# Altium schematic sheet 16_WIFI_BT-1T1R.SchDoc
size A2
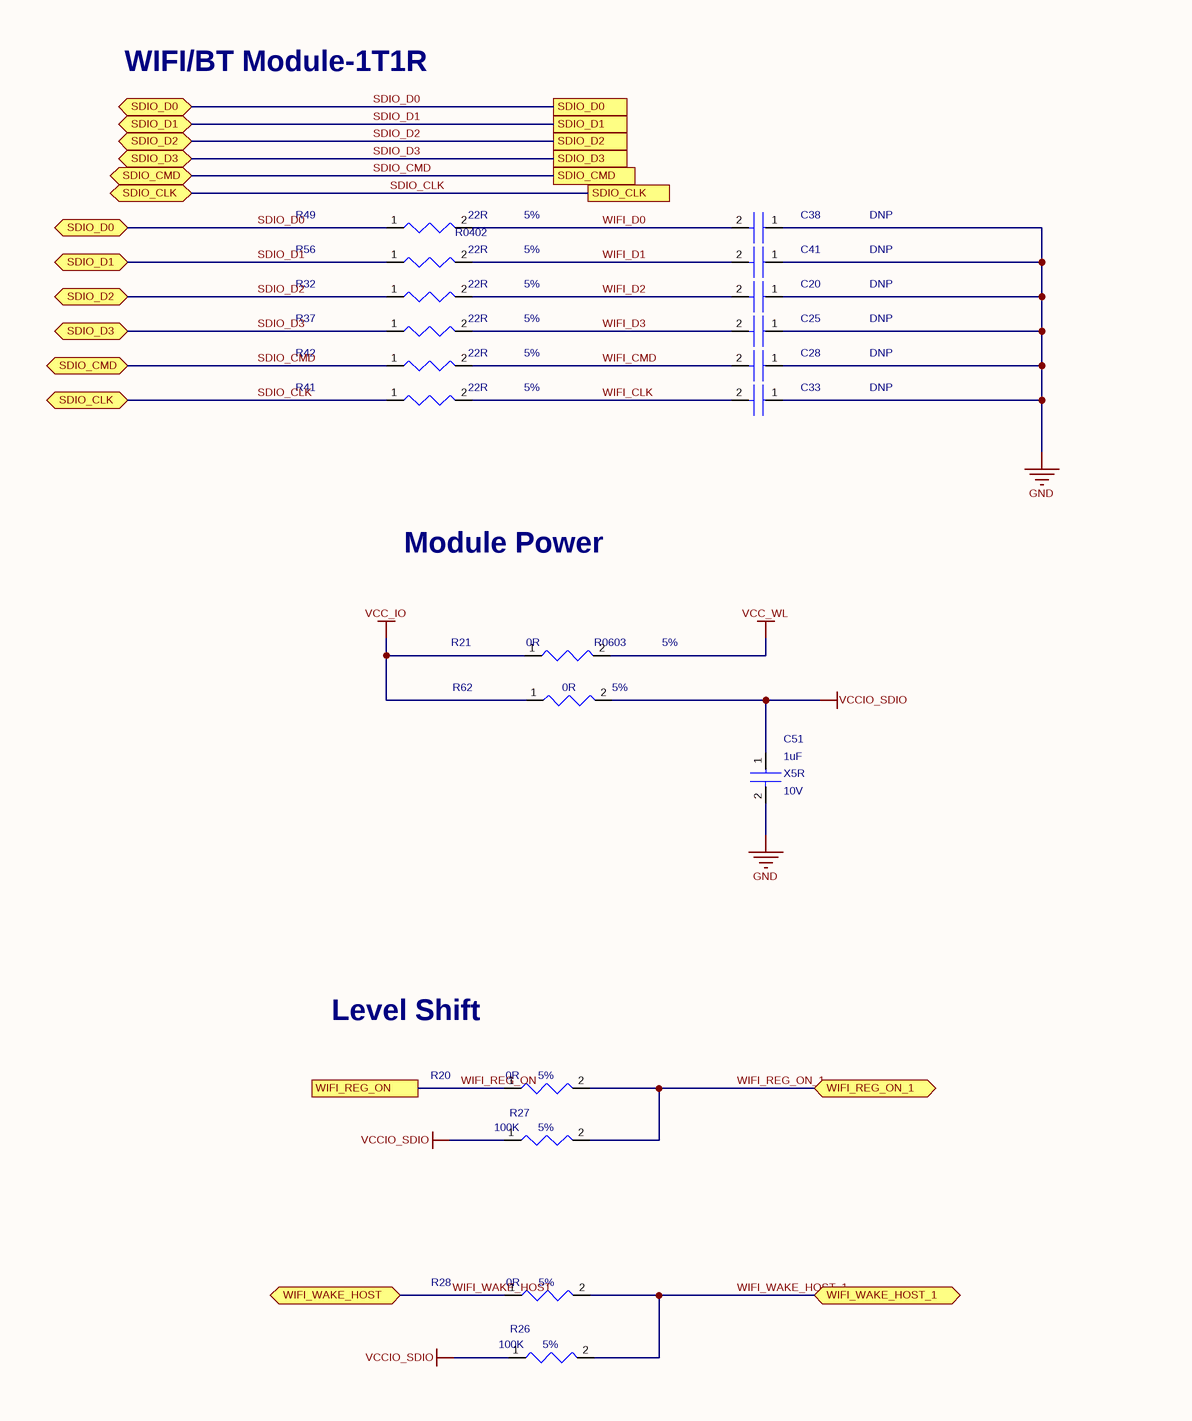
[diagram p0: 16_WIFI_BT-1T1R.SchDoc, left]
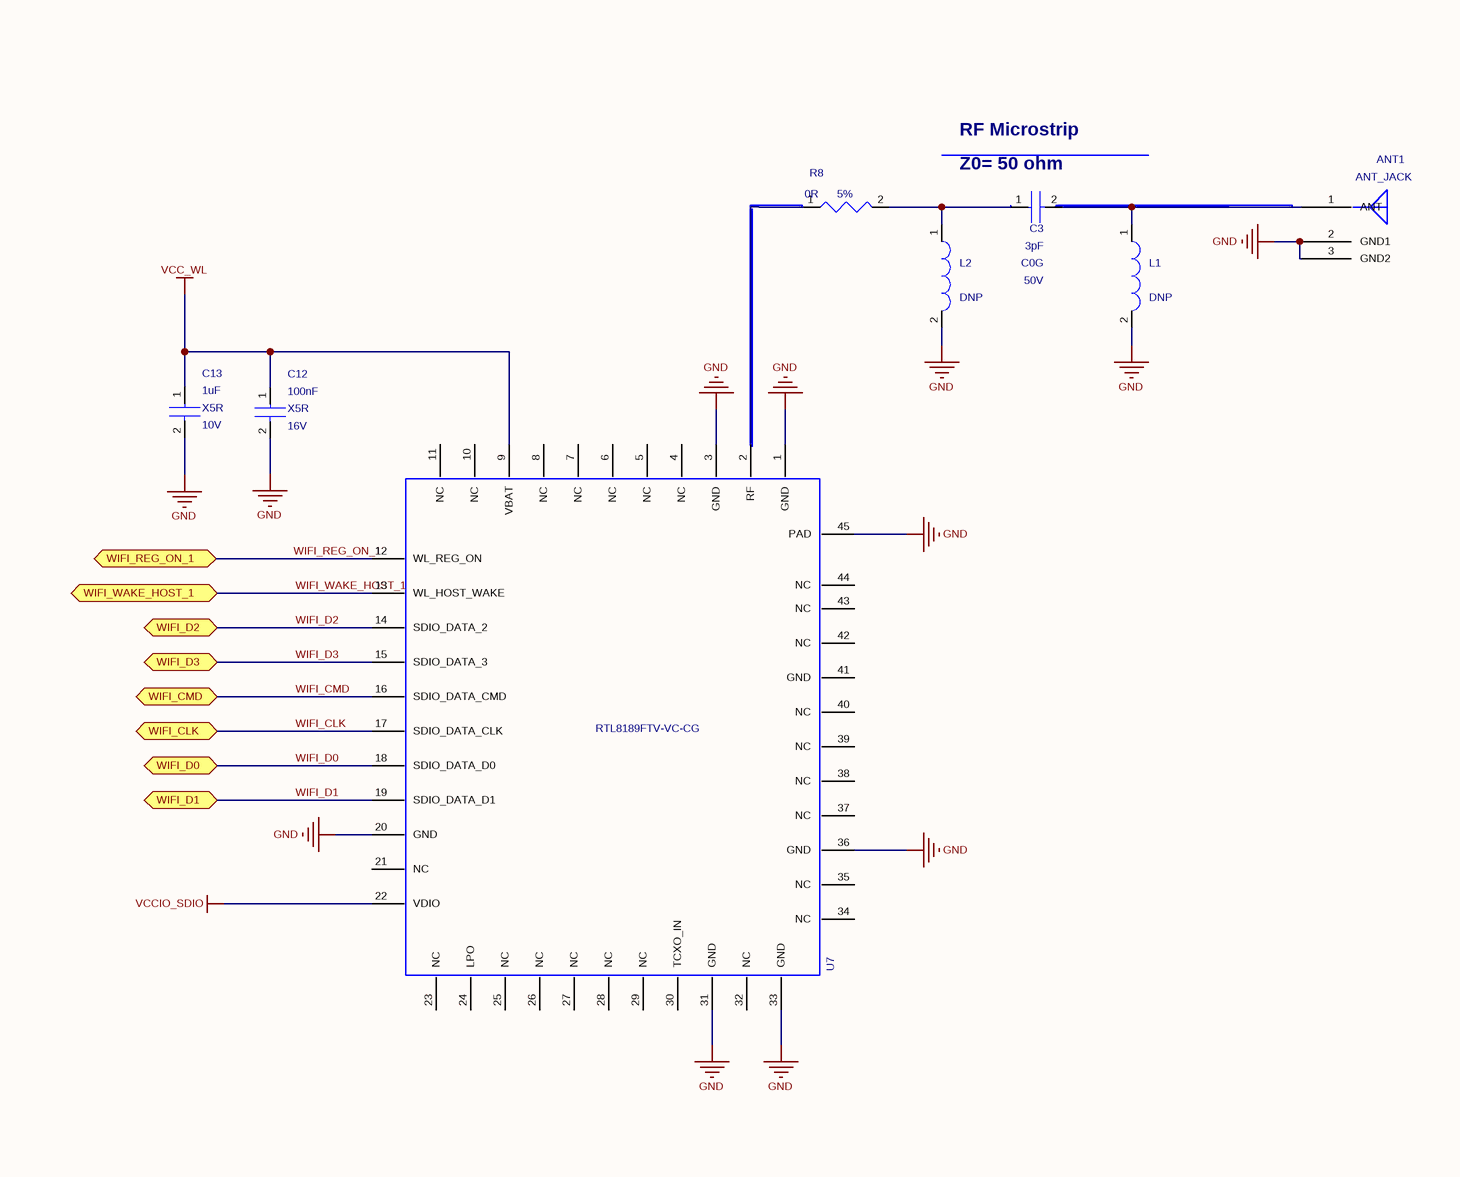
[diagram p1: 16_WIFI_BT-1T1R.SchDoc, right]

## Parts
ANT1  ANT_1P2G  [ANT_JACK]  (value not drawn)
C3  value 3pF  Dielectric: C0G  Voltage: 50V  [C0402]  (hidden comment: CAP_NP_2)
C12  value 100nF  Dielectric: X5R  Voltage: 16V  [C0402]  (hidden comment: CAP_NP_2)
C13  value 1uF  Dielectric: X5R  Voltage: 10V  [C0402]  (hidden comment: CAP_NP_2)
C20  value DNP  [C0402]  (hidden comment: CAP_NP_2)
C25  value DNP  [C0402]  (hidden comment: CAP_NP_2)
C28  value DNP  [C0402]  (hidden comment: CAP_NP_2)
C33  value DNP  [C0402]  (hidden comment: CAP_NP_2)
C38  value DNP  [C0402]  (hidden comment: CAP_NP_2)
C41  value DNP  [C0402]  (hidden comment: CAP_NP_2)
C51  value 1uF  Voltage: 10V  Dielectric: X5R  [C0402]  (hidden comment: CAP_NP_2)
L1  value DNP  [L0402]  (hidden comment: INDUCTOR)
L2  value DNP  [L0402]  (hidden comment: INDUCTOR)
R8  value 0R  Tolerance: 5%  [R0402]  (hidden comment: RESISTOR)
R20  value 0R  Tolerance: 5%  [R0402]  (hidden comment: RESISTOR)
R21  value 0R  Tolerance: 5%  [R0603]  (hidden comment: RESISTOR)
R26  value 100K  Tolerance: 5%  [R0402]  (hidden comment: RESISTOR)
R27  value 100K  Tolerance: 5%  [R0402]  (hidden comment: RESISTOR)
R28  value 0R  Tolerance: 5%  [R0402]  (hidden comment: RESISTOR)
R32  value 22R  Tolerance: 5%  [R0402]  (hidden comment: RESISTOR)
R37  value 22R  Tolerance: 5%  [R0402]  (hidden comment: RESISTOR)
R41  value 22R  Tolerance: 5%  [R0402]  (hidden comment: RESISTOR)
R42  value 22R  Tolerance: 5%  [R0402]  (hidden comment: RESISTOR)
R49  value 22R  Tolerance: 5%  [R0402]  (hidden comment: RESISTOR)
R56  value 22R  Tolerance: 5%  [R0402]  (hidden comment: RESISTOR)
R62  value 0R  Tolerance: 5%  [R0603]  (hidden comment: RESISTOR)
U7  RTL8189FTV-VC-CG  [RTL8189FTV]

## Ports
SDIO_CLK, SDIO_CLK (bidir), SDIO_CMD, SDIO_CMD (bidir), SDIO_D0, SDIO_D0 (bidir), SDIO_D1, SDIO_D1 (bidir), SDIO_D2, SDIO_D2 (bidir), SDIO_D3, SDIO_D3 (bidir), WIFI_CLK (bidir), WIFI_CMD (bidir), WIFI_D0 (bidir), WIFI_D1 (bidir), WIFI_D2 (bidir), WIFI_D3 (bidir), WIFI_REG_ON, WIFI_REG_ON_1 (bidir), WIFI_WAKE_HOST (bidir), WIFI_WAKE_HOST_1 (bidir)

## Nets
GND: ANT1.2(GND1) ANT1.3(GND2) C12.2 C13.2 C20.1 C25.1 C28.1 C33.1 C38.1 C41.1 C51.2 L1.2 L2.2 U7.1(GND) U7.3(GND) U7.20(GND) U7.31(GND) U7.33(GND) U7.36(GND) U7.45(PAD)
VCC_IO: R21.1 R62.1
VCC_WL: C12.1 C13.1 R21.2 U7.9(VBAT)
VCCIO_SDIO: C51.1 R26.1 R27.1 R62.2 U7.22(VDIO)
SDIO_CLK: R41.1 ; port SDIO_CLK
SDIO_CMD: R42.1 ; port SDIO_CMD
SDIO_D0: R49.1 ; port SDIO_D0
SDIO_D1: R56.1 ; port SDIO_D1
SDIO_D2: R32.1 ; port SDIO_D2
SDIO_D3: R37.1 ; port SDIO_D3
WIFI_CLK: C33.2 R41.2 U7.17(SDIO_DATA_CLK) ; port WIFI_CLK
WIFI_CMD: C28.2 R42.2 U7.16(SDIO_DATA_CMD) ; port WIFI_CMD
WIFI_D0: C38.2 R49.2 U7.18(SDIO_DATA_D0) ; port WIFI_D0
WIFI_D1: C41.2 R56.2 U7.19(SDIO_DATA_D1) ; port WIFI_D1
WIFI_D2: C20.2 R32.2 U7.14(SDIO_DATA_2) ; port WIFI_D2
WIFI_D3: C25.2 R37.2 U7.15(SDIO_DATA_3) ; port WIFI_D3
WIFI_REG_ON: R20.1 ; port WIFI_REG_ON
WIFI_REG_ON_1: R20.2 R27.2 U7.12(WL_REG_ON) ; port WIFI_REG_ON_1
WIFI_WAKE_HOST: R28.1 ; port WIFI_WAKE_HOST
WIFI_WAKE_HOST_1: R26.2 R28.2 U7.13(WL_HOST_WAKE) ; port WIFI_WAKE_HOST_1
NetANT1_1: ANT1.1(ANT) C3.2 L1.1
NetC3_1: C3.1 L2.1 R8.2
NetR8_1: R8.1 U7.2(RF)

Not connected (* = marked no-connect by the designer): U7 4(NC) 5(NC) 6(NC) 7(NC) 8(NC) 10(NC) 11(NC) 21(NC) 23(NC) 24(LPO) 25(NC) 26(NC) 27(NC) 28(NC) 29(NC) 30(TCXO_IN) 32(NC) 34(NC) 35(NC) 37(NC) 38(NC) 39(NC) 40(NC) 41(GND) 42(NC) 43(NC) 44(NC)

## Notes on the sheet
- WIFI/BT Module-1T1R
- RF Microstrip
- (near C3) Z0= 50 ohm
- Module Power
- (near R20) Level Shift
- Title
- Size:
- Date:
- File:
- A2
- Number:
- Time:
- Revision:
- Sheet
- of

## Library data of the parts
ANT1 = ANT_1P2G: 焊接式WIFI天线座，单频; Manufacturer_PN: KH-IPEX-K501-29; Part_Type: ANT; Created_by: JJJ; Priority: A; Source_Path: Z:\RK_STANDARD_LIBRARY\CADENCE_CIS\RK_DISCRETE.OLB; Value: ANT_JACK; Number: 1; PCB DECAL: ANT_JACK; RK_PN: ANT_JACK
C3 = CAP_NP_2: cap,3.00pF,+/-0.1,50V,C0G,C0402; Manufacturer: TDK; RK_PN: C1005C0G1H030B050BA; Priority: A; Tolerance: +/-0.1pF; Created_by: JJJ; Source_Path: Z:\RK_STANDARD_LIBRARY\CADENCE_CIS\RK_DISCRETE.OLB; PCB DECAL: C0402; Part_Type: C0402; Manufacturer_PN: C1005C0G1H030B050BA
C12 = CAP_NP_2: cap,100.00nF,+/-10%,16V,X5R,C0402; Manufacturer: TDK; Number: 1; RK_PN: C1005X5R1C104K050BA; Priority: A; Tolerance: 10%; C_Voltage: 10V; Created_by: JJJ; Source_Path: Z:\RK_STANDARD_LIBRARY\CADENCE_CIS\RK_DISCRETE.OLB; PCB DECAL: C0402; Part_Type: C0402; Manufacturer_PN: C1005X5R1C104K050BA
C13 = CAP_NP_2: cap,1.00uF,+/-10%,10V,X5R,C0402; Manufacturer: TDK; RK_PN: C1005X5R1A105K050BB; Priority: A; Tolerance: 10%; Created_by: JJJ; Source_Path: Z:\RK_STANDARD_LIBRARY\CADENCE_CIS\RK_DISCRETE.OLB; PCB DECAL: C0402; Part_Type: C0402; Manufacturer_PN: C1005X5R1A105K050BB
C20 C25 C28 C41 = CAP_NP_2: Did Not Place.; Manufacturer_PN: DNPC0402; Created_by: JJJ; Priority: A; Source_Path: Z:\RK_STANDARD_LIBRARY\CADENCE_CIS\RK_DISCRETE.OLB; number: 1; PCB DECAL: C0402; Part_Type: DNP; RK_PN: DNPC0402; Option: DNP
C33 C38 = CAP_NP_2: Did Not Place.; RK_PN: DNPC0402; Priority: A; Created_by: JJJ; Source_Path: Z:\RK_STANDARD_LIBRARY\CADENCE_CIS\RK_DISCRETE.OLB; number: 1; PCB DECAL: C0402; Part_Type: DNP; Manufacturer_PN: DNPC0402; Option: DNP
C51 = CAP_NP_2: cap,1.00uF,+/-10%,10V,X5R,C0402; Manufacturer_PN: C1005X5R1A105K050BB; Manufacturer: TDK; Created_by: JJJ; Tolerance: 10%; C_Voltage: 6.3V; Priority: A; Source_Path: Z:\RK_STANDARD_LIBRARY\CADENCE_CIS\RK_DISCRETE.OLB; PCB DECAL: C0402; Part_Type: C0402; RK_PN: C1005X5R1A105K050BB
L1 = INDUCTOR: Did Not Place.; Part_Type: IND; Created_by: JJJ; Priority: A; RK_PN: DNPL0402; Source_Path: Z:\RK_STANDARD_LIBRARY\CADENCE_CIS\RK_DISCRETE.OLB; Number: 1; PCB DECAL: L0402; Option: DNP
L2 = INDUCTOR: Did Not Place.; Part_Type: IND; RK_PN: DNPL0402; Priority: A; Created_by: JJJ; Source_Path: Z:\RK_STANDARD_LIBRARY\CADENCE_CIS\RK_DISCRETE.OLB; Number: 1; PCB DECAL: L0402; Option: DNP
R8 = RESISTOR: ?用厚膜电阻,0R,+/-5%,R0402,1/16W.; Manufacturer: YAGEO; RK_PN: RC0402JR-070RL; Priority: A; Wattage: 1/16W; Created_by: YTL; Source_Path: Z:\RK_STANDARD_LIBRARY\CADENCE_CIS\RK_DISCRETE.OLB; Number: 1; PCB DECAL: R0402; Part_Type: ?用厚膜电阻; Manufacturer_PN: RC0402JR-070RL
R20 R28 = RESISTOR: ?用厚膜电阻,10K,+/-5%,R0402,1/16W.; Manufacturer_PN: RC0402JR-0710KL; Manufacturer: YAGEO; Created_by: YTL; Wattage: 1/16W; Priority: A; Source_Path: Z:\RK_STANDARD_LIBRARY\CADENCE_CIS\RK_DISCRETE.OLB; Number: 1; PCB DECAL: R0402; Part_Type: ?用厚膜电阻; RK_PN: RC0402JR-0710KL
R21 = RESISTOR: ?用厚膜电阻,0R,+/-5%,R0603,1/10W.; Manufacturer_PN: RC0603JR-070RL; Manufacturer: YAGEO; Created_by: YTL; Wattage: 1/10W; Priority: A; Source_Path: Z:\RK_STANDARD_LIBRARY\CADENCE_CIS\RK_DISCRETE.OLB; Number: 1; PCB DECAL: R0603; Part_Type: ?用厚膜电阻; RK_PN: RC0603JR-070RL
R26 R27 = RESISTOR: ?用厚膜电阻,100K,+/-5%,R0402,1/16W.; Manufacturer: YAGEO; RK_PN: RC0402JR-07100KL; Priority: A; Wattage: 1/16W; Created_by: YTL; Source_Path: Z:\RK_STANDARD_LIBRARY\CADENCE_CIS\RK_DISCRETE.OLB; Number: 1; PCB DECAL: R0402; Part_Type: ?用厚膜电阻; Manufacturer_PN: RC0402JR-07100KL
R32 R37 R41 R42 R56 = RESISTOR: ?用厚膜电阻,22R,+/-5%,R0402,1/16W.; Manufacturer_PN: RC0402JR-0722RL; Manufacturer: YAGEO; Created_by: YTL; Wattage: 1/16W; Priority: A; Source_Path: Z:\RK_STANDARD_LIBRARY\CADENCE_CIS\RK_DISCRETE.OLB; number: 1; PCB DECAL: R0402; Part_Type: ?用厚膜电阻; RK_PN: RC0402JR-0722RL
R49 = RESISTOR: ?用厚膜电阻,22R,+/-5%,R0402,1/16W.; Manufacturer: YAGEO; RK_PN: RC0402JR-0722RL; Priority: A; Wattage: 1/16W; Created_by: YTL; Source_Path: Z:\RK_STANDARD_LIBRARY\CADENCE_CIS\RK_DISCRETE.OLB; number: 1; PCB DECAL: R0402; Part_Type: ?用厚膜电阻; Manufacturer_PN: RC0402JR-0722RL
R62 = RESISTOR: ?用厚膜电阻,0R,+/-5%,R0402,1/16W.; Manufacturer_PN: RC0402JR-070RL; Manufacturer: YAGEO; Created_by: YTL; Wattage: 1/16W; Priority: A; Source_Path: Z:\RK_STANDARD_LIBRARY\CADENCE_CIS\RK_DISCRETE.OLB; Number: 1; PCB DECAL: R0603; Part_Type: ?用厚膜电阻; RK_PN: RC0402JR-070RL
U7 = RTL8189FTV-VC-CG: IEEE 802.11 b/g/n 2.4GHz 1T1R SDIO LGA Module; Number: 1; value: RTL8189FTV-VC-CG; PCB DECAL: RTL8189FTV; Manufacturer_PN: RTL8189FTV-VC-CG